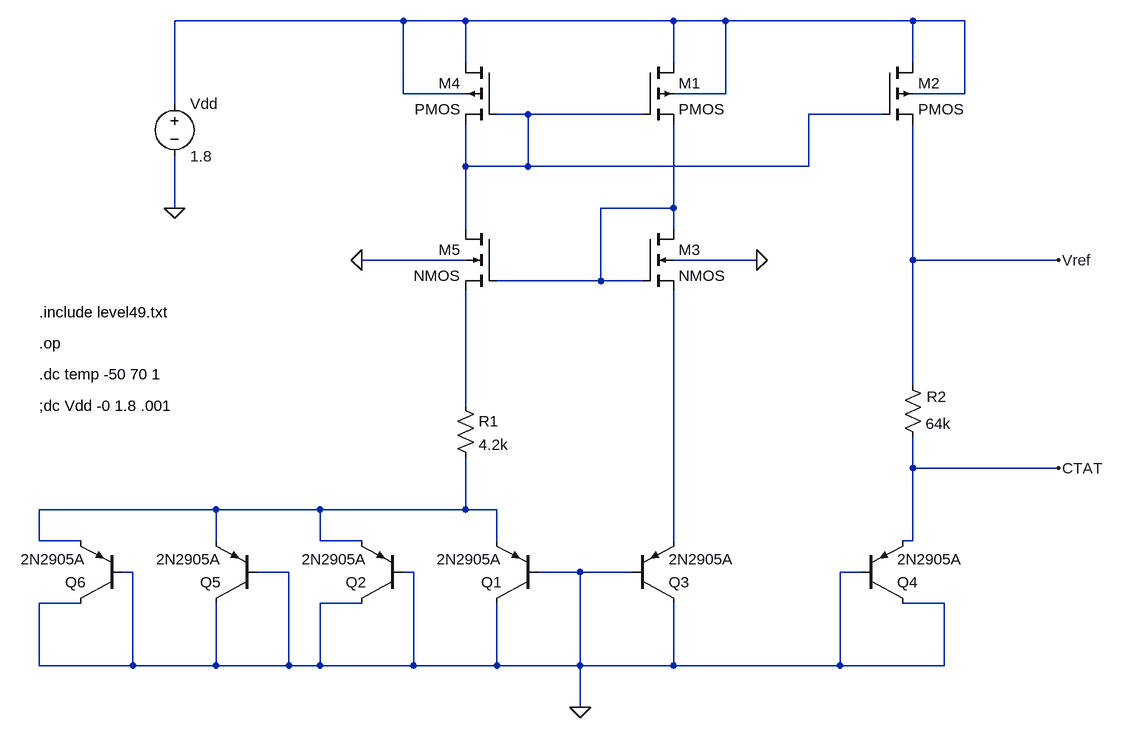
[diagram p0: schematic BGR1.asc]
BGR1.asc, the LTspice schematic file:
Version 4
SHEET 1 2044 1636
WIRE -80 432 -432 432
WIRE 16 432 -80 432
WIRE 336 432 16 432
WIRE 416 432 336 432
WIRE 704 432 416 432
WIRE 784 432 704 432
WIRE 16 496 16 432
WIRE 336 496 336 432
WIRE 704 496 704 432
WIRE -80 544 -80 432
WIRE 16 544 -80 544
WIRE 416 544 416 432
WIRE 416 544 336 544
WIRE 784 544 784 432
WIRE 784 544 704 544
WIRE -432 560 -432 432
WIRE 112 576 64 576
WIRE 288 576 112 576
WIRE 656 576 544 576
WIRE 16 656 16 592
WIRE 112 656 112 576
WIRE 112 656 16 656
WIRE 544 656 544 576
WIRE 544 656 112 656
WIRE -432 720 -432 640
WIRE 336 720 336 592
WIRE 336 720 224 720
WIRE 16 752 16 656
WIRE 336 752 336 720
WIRE 16 800 -144 800
WIRE 464 800 336 800
WIRE 704 800 704 592
WIRE 928 800 704 800
WIRE 224 832 224 720
WIRE 224 832 64 832
WIRE 288 832 224 832
WIRE 704 992 704 800
WIRE 16 1024 16 848
WIRE 704 1120 704 1072
WIRE 928 1120 704 1120
WIRE -368 1184 -640 1184
WIRE -208 1184 -368 1184
WIRE 16 1184 16 1104
WIRE 16 1184 -208 1184
WIRE 64 1184 16 1184
WIRE -640 1232 -640 1184
WIRE -576 1232 -640 1232
WIRE -368 1232 -368 1184
WIRE -208 1232 -208 1184
WIRE -144 1232 -208 1232
WIRE 64 1232 64 1184
WIRE 336 1232 336 848
WIRE 704 1232 704 1120
WIRE 704 1232 688 1232
WIRE -496 1280 -512 1280
WIRE -256 1280 -304 1280
WIRE -64 1280 -80 1280
WIRE 192 1280 128 1280
WIRE 272 1280 192 1280
WIRE 624 1280 592 1280
WIRE -576 1328 -640 1328
WIRE -144 1328 -208 1328
WIRE 752 1328 688 1328
WIRE -640 1424 -640 1328
WIRE -496 1424 -496 1280
WIRE -496 1424 -640 1424
WIRE -368 1424 -368 1328
WIRE -368 1424 -496 1424
WIRE -256 1424 -256 1280
WIRE -256 1424 -368 1424
WIRE -208 1424 -208 1328
WIRE -208 1424 -256 1424
WIRE -64 1424 -64 1280
WIRE -64 1424 -208 1424
WIRE 64 1424 64 1328
WIRE 64 1424 -64 1424
WIRE 192 1424 192 1280
WIRE 192 1424 64 1424
WIRE 336 1424 336 1328
WIRE 336 1424 192 1424
WIRE 592 1424 592 1280
WIRE 592 1424 336 1424
WIRE 752 1424 752 1328
WIRE 752 1424 592 1424
WIRE 192 1488 192 1424
FLAG 192 1488 0
FLAG 464 800 0
FLAG -144 800 0
FLAG -432 720 0
FLAG 928 800 Vref
FLAG 928 1120 CTAT
SYMBOL pmos4 656 496 R0
SYMATTR InstName M2
SYMATTR Value2 l=180n w=250n
SYMBOL pmos4 64 496 M0
SYMATTR InstName M4
SYMATTR Value2 l=180n w=250n
SYMBOL nmos4 288 752 R0
SYMATTR InstName M3
SYMATTR Value2 l=180n w=250n
SYMBOL nmos4 64 752 M0
SYMATTR InstName M5
SYMATTR Value2 l=180n w=250n
SYMBOL pnp 128 1328 R180
SYMATTR InstName Q1
SYMATTR Value 2N2905A
SYMBOL pnp -80 1328 R180
SYMATTR InstName Q2
SYMATTR Value 2N2905A
SYMBOL pnp 272 1328 M180
SYMATTR InstName Q3
SYMATTR Value 2N2905A
SYMBOL pnp 624 1328 M180
SYMATTR InstName Q4
SYMATTR Value 2N2905A
SYMBOL res 0 1008 R0
SYMATTR InstName R1
SYMATTR Value 4.2k
SYMBOL res 688 976 R0
WINDOW 0 37 34 Left 2
SYMATTR InstName R2
SYMATTR Value 64k
SYMBOL voltage -432 544 R0
WINDOW 123 0 0 Left 0
WINDOW 39 0 0 Left 0
SYMATTR InstName Vdd
SYMATTR Value 1.8
SYMBOL pmos4 288 496 R0
SYMATTR InstName M1
SYMATTR Value2 l=180n w=250n
SYMBOL pnp -304 1328 R180
SYMATTR InstName Q5
SYMATTR Value 2N2905A
SYMBOL pnp -512 1328 R180
SYMATTR InstName Q6
SYMATTR Value 2N2905A
TEXT -640 976 Left 2 !.dc temp -50 70 1
TEXT -640 880 Left 2 !.include level49.txt
TEXT -640 1024 Left 2 !;dc Vdd -0 1.8 .001
TEXT -640 928 Left 2 !.op

The netlist it stands for:
* BGR1.asc
M2 N001 N002 Vref N001 PMOS l=180n w=250n
M4 N001 N002 N002 N001 PMOS l=180n w=250n
M3 N003 N003 N006 0 NMOS l=180n w=250n
M5 N002 N003 N004 0 NMOS l=180n w=250n
Q1 0 0 N005 0 2N2905A
Q2 0 0 N005 0 2N2905A
Q3 0 0 N006 0 2N2905A
Q4 0 0 CTAT 0 2N2905A
R1 N004 N005 4.2k
R2 Vref CTAT 64k
Vdd N001 0 1.8
M1 N001 N002 N003 N001 PMOS l=180n w=250n
Q5 0 0 N005 0 2N2905A
Q6 0 0 N005 0 2N2905A
.model NPN NPN
.model PNP PNP
.lib standard.bjt
.model NMOS NMOS
.model PMOS PMOS
.lib standard.mos
.dc temp -50 70 1
.include level49.txt
;dc Vdd -0 1.8 .001
.op
.backanno
.end